# Altium project Tx_555.PrjPcb
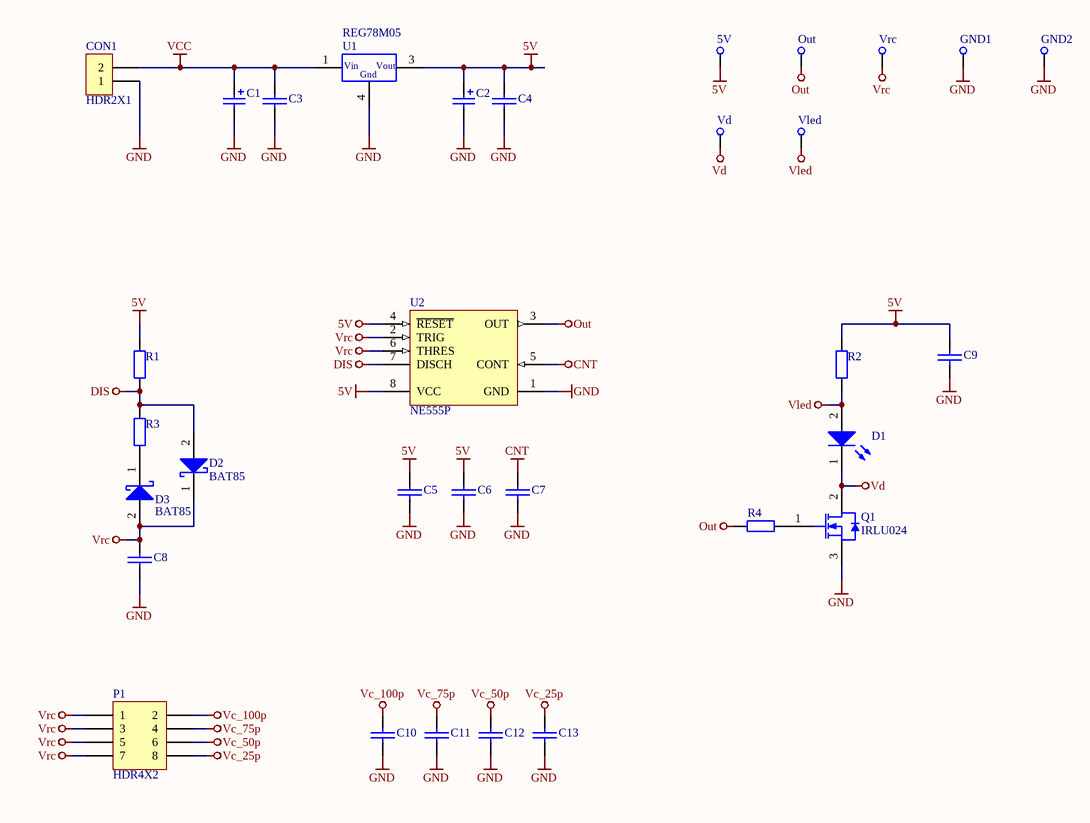
[diagram p0: Tx_555_Sch.SchDoc]
1 sheet, 32 parts. Net scope: global (net labels, ports and power ports of the same name join across sheets).
Board file: Tx_555_PCB.PcbDoc

## Sheet Tx_555_Sch.SchDoc: NE555 Based IR Transmitter
size A4; Author: Duleepa J Thrimawithana; Organization: Power Electronics Group; Address1: The University of Auckland; Address2: 20 Symonds Street; Address3: Auckland 1010; Address4: New Zealand; Revision: 1R0; SheetNumber: 1; SheetTotal: 1

### Parts
5V  TP TH  [TP_TH_2.5mm]  (value not drawn)
C1  ECAP  [CR05]  (value not drawn)
C2  ECAP  [CR05]  (value not drawn)
C3  CCAP_TH_5P0  [CCAP_5P0]  (value not drawn)
C4  CCAP_TH_5P0  [CCAP_5P0]  (value not drawn)
C5  CCAP_TH_5P0  [CCAP_5P0]  (value not drawn)
C6  CCAP_TH_5P0  [CCAP_5P0]  (value not drawn)
C7  CCAP_TH_5P0  [CCAP_5P0]  (value not drawn)
C8  CCAP_TH_5P0  [CCAP_5P0]  (value not drawn)
C9  CCAP_TH_5P0  [CCAP_5P0]  (value not drawn)
C10  CCAP_TH_5P0  [CCAP_5P0]  (value not drawn)
C11  CCAP_TH_5P0  [CCAP_5P0]  (value not drawn)
C12  CCAP_TH_5P0  [CCAP_5P0]  (value not drawn)
C13  CCAP_TH_5P0  [CCAP_5P0]  (value not drawn)
CON1  HDR2X1  [HDR2X1_2P54]
D1  LED_TH  [TH_LED]  (value not drawn)
D2  BAT85  [FP-SOD68-MFG]
D3  BAT85  [FP-SOD68-MFG]
GND1  TP TH  [TP_TH_2.5mm]  (value not drawn)
GND2  TP TH  [TP_TH_2.5mm]  (value not drawn)
Out  TP TH  [TP_TH_2.5mm]  (value not drawn)
P1  HDR4X2  [HDR4X2-2P54]
Q1  IRLU024  [FP-PG-TO251-3-MFG]
R1  RESAX4  [RAX4]  (value not drawn)
R2  RESAX4  [RAX4]  (value not drawn)
R3  RESAX4  [RAX4]  (value not drawn)
R4  RESAX4  [RAX4]  (value not drawn)
U1  REG78M05  [TO220_Reg]
U2  NE555P  [P0008A]
Vd  TP TH  [TP_TH_2.5mm]  (value not drawn)
Vled  TP TH  [TP_TH_2.5mm]  (value not drawn)
Vrc  TP TH  [TP_TH_2.5mm]  (value not drawn)

### Nets
5V: 5V.1 C2.1 C4.2 C5.2 C6.2 C9.2 R1.2 R2.2 U1.3(Vout) U2.4(~{RESET}) U2.8(VCC)
CNT: C7.2 U2.5(CONT)
DIS: D2.2(A) R1.1 R3.2 U2.7(DISCH)
GND: C1.2 C2.2 C3.1 C4.1 C5.1 C6.1 C7.1 C8.1 C9.1 C10.1 C11.1 C12.1 C13.1 CON1.1 GND1.1 GND2.1 Q1.3(SOURCE) U1.4(Gnd) U2.1(GND)
Out: Out.1 R4.2 U2.3(OUT)
Vc_25p: C13.2 P1.8
Vc_50p: C12.2 P1.6
Vc_75p: C11.2 P1.4
Vc_100p: C10.2 P1.2
VCC: C1.1 C3.2 CON1.2 U1.1(Vin)
Vd: D1.1(C) Q1.2(DRAIN) Vd.1
Vled: D1.2(A) R2.1 Vled.1
Vrc: C8.2 D2.1(C) D3.2(A) P1.1 P1.3 P1.5 P1.7 U2.2(TRIG) U2.6(THRES) Vrc.1
NetD3_1: D3.1(C) R3.1
NetQ1_1: Q1.1(GATE) R4.1

### Notes on the sheet
- Title:
- Author:
- Date:
- Time:
- Revision:
- Sheet
- of
- File:

### Library data of the parts
5V GND1 GND2 Out Vd Vled Vrc = CMP-046-000000-3: Testpoint through hole / Keystone compact / 5000 - Red / 5001 - Black / 5002 - White / 5003 - Orange / 5004 - Yellow; Source: UoAPE_Connectors and Mechanical.SchLib; Design Item ID: TP TH
C1 C2 = CMP-003-000000-2: Source: CommonSymbols_V1.SchLib; Design Item ID: ECAP
C3-C13 = CMP-001-00023-1: TH ceramic cap with 5mm pitch; Design Item ID: CCAP_5P0
CON1 = CMP-004-000000-7: Header 2X1; Design Item ID: HDR2X1; Source: CommonSymbols_V1.SchLib
D1 = CMP-007-00002-1: LED RED TH
D2 D3 = CMP-00011-1: Rectifier Diode, Schottky, 1 Phase, 1 Element, 0.2A, 30V V(RRM), Silicon, DO-34; Time @ Peak Reflow Temperature-Max (s): 40s; Number of Elements: 1; Max Power Dissipation: 200mW; Forward Voltage: 800mV; Non-rep Pk Forward Current-Max: 600mA; Case Connection: Isolated; Package Body Material: Glass; Max Reverse Current: 2uA; Max Output current: 200mA; Reverse Recovery Time-Max: 0.004us; Surface Mount: No; Qualification Status: Not Qualified; JESD-609 Code: e3; Min Operating Temperature: -55°C; Reach SVHC Compliant: Yes; Terminal Finish: Tin; JEDEC-95 Code: DO-34; Technology: SCHOTTKY; Package Style: LONG FORMMeter; Moisture Sensitivity Level: 1; Terminal Form: Wire; JESD-30 Code: O-LALF-W2; Peak Reflow Temperature (Cel): 260°C; Max Operating Temperature: 125°C; Pins: 2; RoHS Compliant: Yes; Diode Type: RECTIFIER; Diode Element Material: SILICON; Rep Pk Reverse Voltage-Max: 30V; Terminal Position: AXIAL; Package Shape: Round
P1 = CMP-002-00015-5: Header, 8-Pin, Dual row; Source: CommonSymbols_V1.SchLib; Design Item ID: HDR3X2
Q1 = CMP-013-00004-1: Power Field-Effect Transistor, 80A I(D), 75V, 0.009ohm, 1-Element, N-Channel, Silicon, Metal-oxide Semiconductor FET, TO-251AA; Avalanche Energy Rating (Eas): 120mJ; Power Dissipation-Max (Abs): 140W; Time @ Peak Reflow Temperature-Max (s): 30s; Number of Elements: 1; Operating Mode: ENHANCEMENT MODE; Pulsed Drain Current-Max (IDM): 310A; Drain-source On Resistance-Max: 9mR; Surface Mount: No; Qualification Status: Not Qualified; Transistor Application: SWITCHING; Package Body Material: Plastic; Case Connection: DRAIN; Peak Reflow Temperature (Cel): 260°C; Drain Current-Max (ID): 80A; Max Operating Temperature: 175°C; JESD-30 Code: R-PSIP-T3; Moisture Sensitivity Level: 1; Polarity/Channel Type: N-CHANNEL; Reach SVHC Compliant: Yes; Package Shape: Rectangular; Terminal Finish: Nickel; Transistor Element Material: SILICON; Drain Current-Max (Abs) (ID): 80A; FET Technology: METAL-OXIDE SEMICONDUCTOR; DS Breakdown Voltage-Min: 75V; Pins: 3; Terminal Form: Through Hole; Terminal Position: SINGLE; JESD-609 Code: e3; Package Style: IN-LINEMeter; RoHS Compliant: Yes; JEDEC-95 Code: TO-251AA
R1-R4 = CMP-010-000001-2: Axial Resistor; Design Item ID: RESAX4; Source: CommonSymbols_V1.SchLib
U1 = CMP-011-000018-2: 78M Series Linear Regulators; Source: CommonSymbols_V1.SchLib; Design Item ID: REG78MXX
U2 = CMP-00023-00000-1: 1 Func, BIPolar, PDIP8; Package Body Material: Plastic; Surface Mount: No; Channels: 1; Power Supplies: 5/15V; Nominal Supply Voltage: 5V; Max Supply Voltage: 16V; Package Equivalence Code: DIP8,.3; Qualification Status: Not Qualified; Min Supply Voltage: 4.5V; Throw Configuration: PULSE; RECTANGULAR; Width: 7.62mm; Terminal Finish: Tin; Length: 9.81mm; Terminal Pitch: 2.54mm; Max Operating Temperature: 70°C; Terminal Position: DUAL; Pins: 8; Terminal Form: Through Hole; Min Operating Temperature: 0°C; Height - Seated (Max): 5.08mm; JESD-609 Code: e3; Temperature Grade: COMMERCIAL; Package Style: IN-LINEMeter; Case/Package: DIP; Package Shape: Rectangular; RoHS Compliant: Yes; Technology: BIPOLAR; Reach SVHC Compliant: Yes; JESD-30 Code: R-PDIP-T8